# EAGLE schematic AM3352-SOM-EVB_Rev_D (EAGLE 4.16)
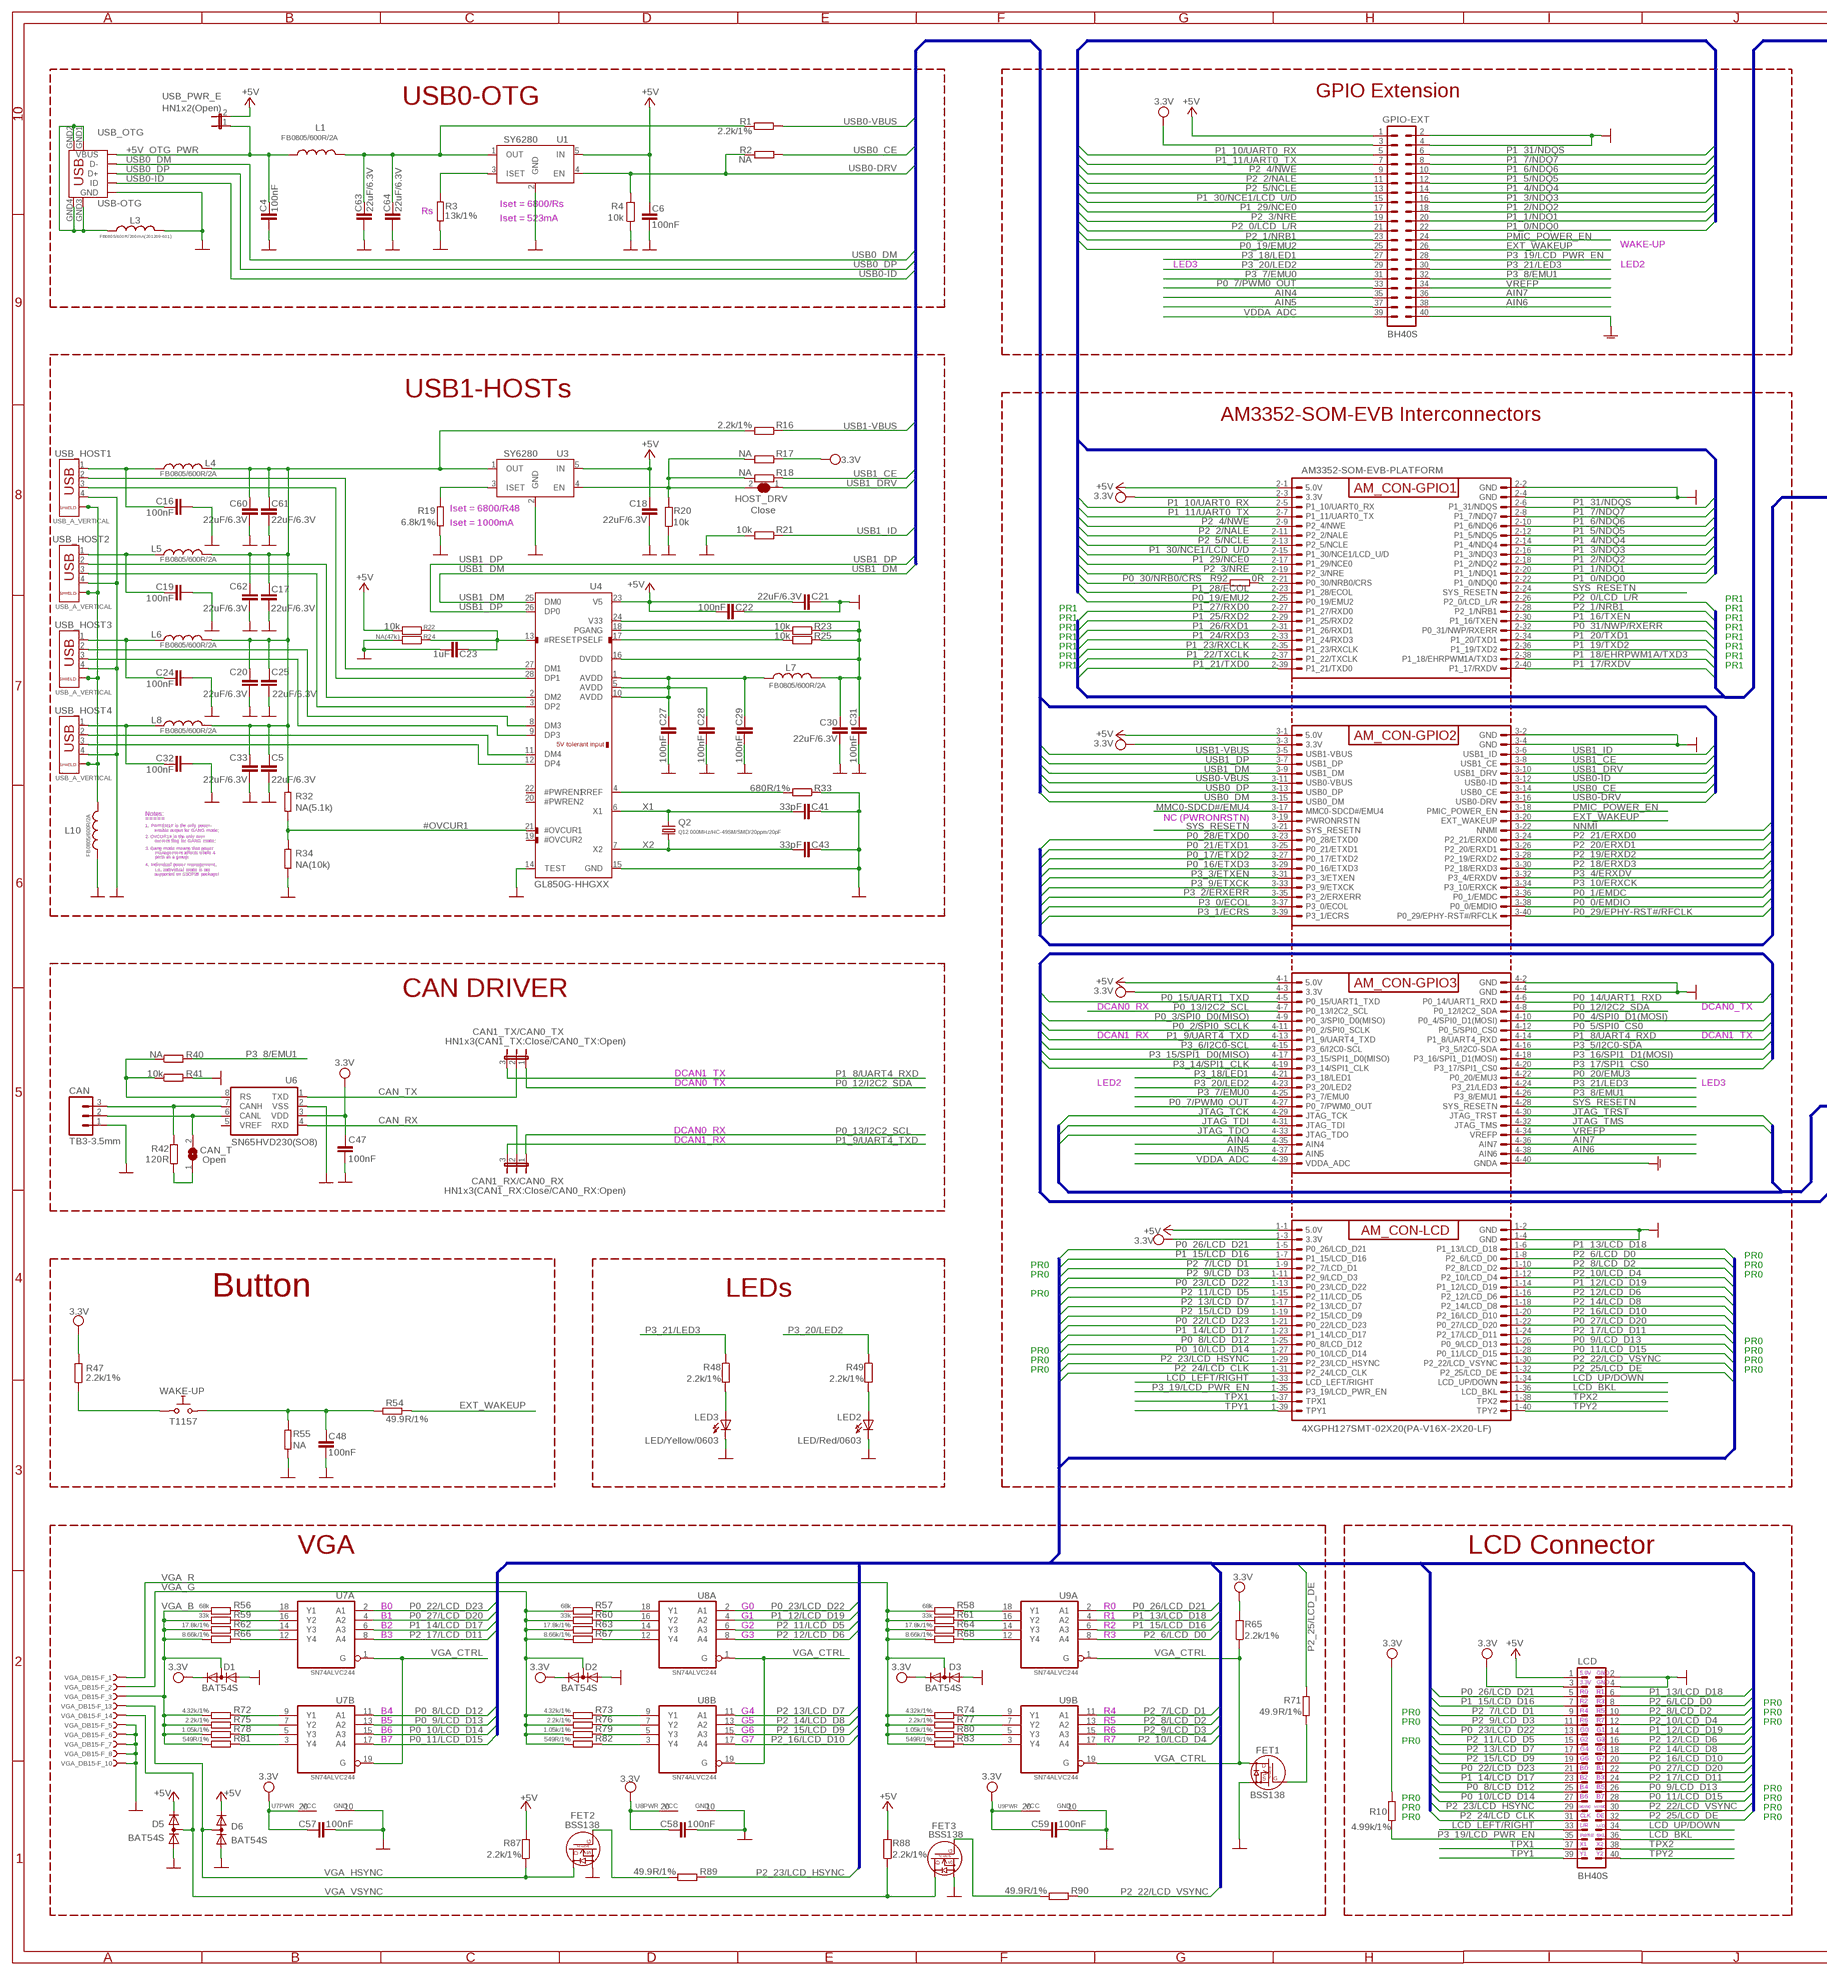
[diagram p0: schematic, sheet 1, part 1 of 2]
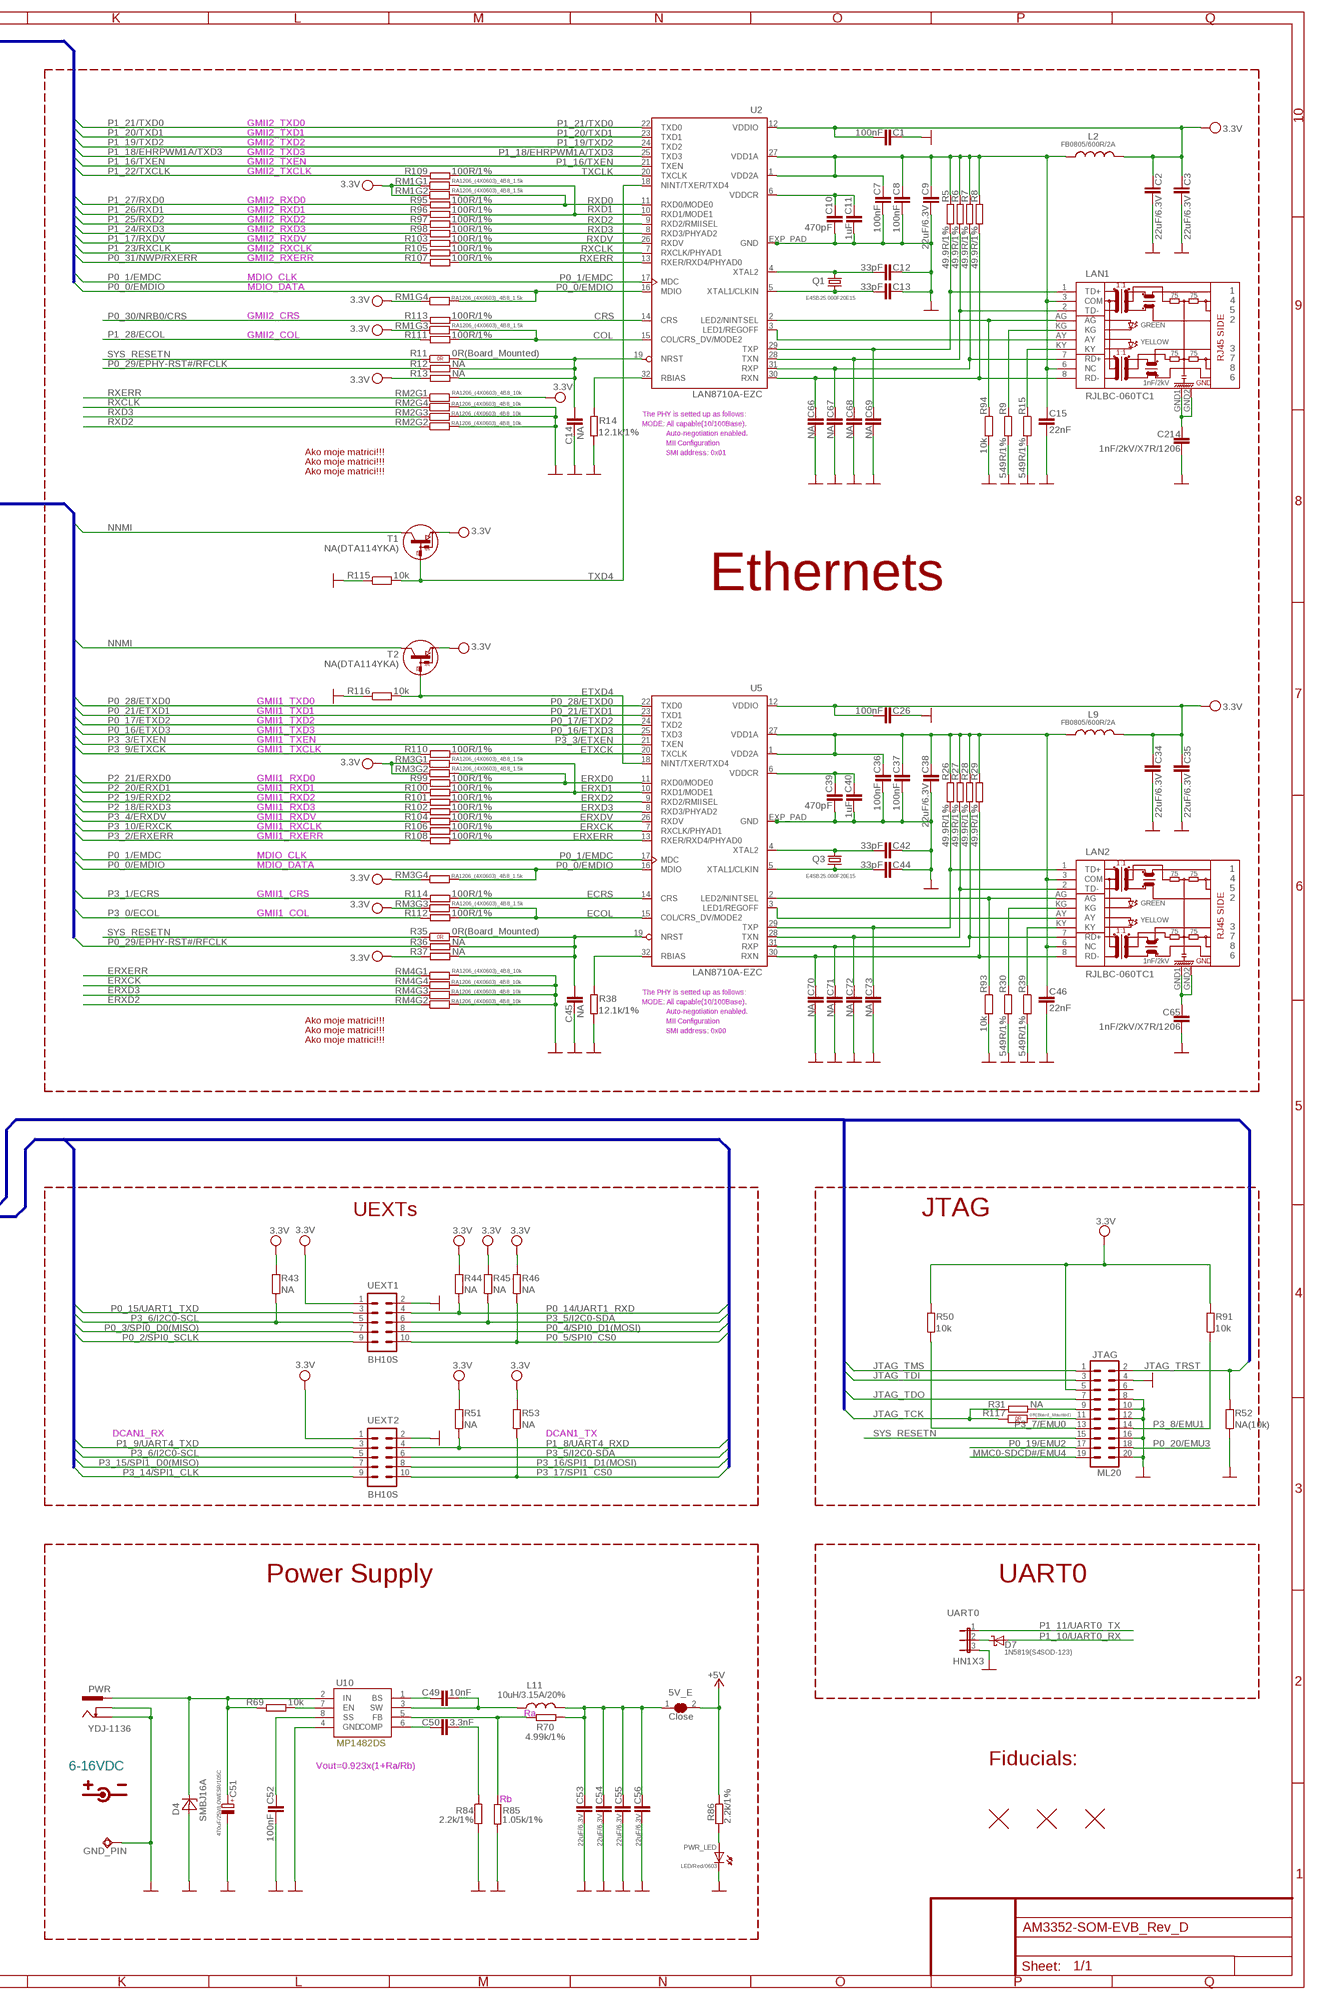
[diagram p1: schematic, sheet 1, part 2 of 2]

## Parts
5V_E  Close  SJSJ-CLOSE  [SJ-CLOSE]
AM3352-SOM-EVB-PLATFORM  4XGPH127SMT-02X20(PA-V16X-2X20-LF)  AM3352-SOM-EVB---4XGPH127SMT-02X20(PA-V16X-2X20-LF)  [AM3352-SOM-EVB]
C1  100nF  C-EUC0603_DWS  [C0603_DWS]
C2  22uF/6.3V  C-EUC0603_DWS  [C0603_DWS]
C3  22uF/6.3V  C-EUC0603_DWS  [C0603_DWS]
C4  100nF  C-EUC0603_DWS  [C0603_DWS]
C5  22uF/6.3V  C-EUC0603_DWS  [C0603_DWS]
C6  100nF  C-EUC0603_DWS  [C0603_DWS]
C7  100nF  C-EUC0603_DWS  [C0603_DWS]
C8  100nF  C-EUC0603_DWS  [C0603_DWS]
C9  22uF/6.3V  C-EUC0603_DWS  [C0603_DWS]
C10  470pF  C-EUC0603_DWS  [C0603_DWS]
C11  1uF  C-EUC0603_DWS  [C0603_DWS]
C12  33pF  C-EUC0603_DWS  [C0603_DWS]
C13  33pF  C-EUC0603_DWS  [C0603_DWS]
C14  NA  C-EUC0603_DWS  [C0603_DWS]
C15  22nF  C-EUC0603_DWS  [C0603_DWS]
C16  100nF  C-EUC0603_DWS  [C0603_DWS]
C17  22uF/6.3V  C-EUC0603_DWS  [C0603_DWS]
C18  22uF/6.3V  C-EUC0603_DWS  [C0603_DWS]
C19  100nF  C-EUC0603_DWS  [C0603_DWS]
C20  22uF/6.3V  C-EUC0603_DWS  [C0603_DWS]
C21  22uF/6.3V  C-EUC0603_DWS  [C0603_DWS]
C22  100nF  C-EUC0603_DWS  [C0603_DWS]
C23  1uF  C-EUC0603_DWS  [C0603_DWS]
C24  100nF  C-EUC0603_DWS  [C0603_DWS]
C25  22uF/6.3V  C-EUC0603_DWS  [C0603_DWS]
C26  100nF  C-EUC0603_DWS  [C0603_DWS]
C27  100nF  C-EUC0603_DWS  [C0603_DWS]
C28  100nF  C-EUC0603_DWS  [C0603_DWS]
C29  100nF  C-EUC0603_DWS  [C0603_DWS]
C30  22uF/6.3V  C-EUC0603_DWS  [C0603_DWS]
C31  100nF  C-EUC0603_DWS  [C0603_DWS]
C32  100nF  C-EUC0603_DWS  [C0603_DWS]
C33  22uF/6.3V  C-EUC0603_DWS  [C0603_DWS]
C34  22uF/6.3V  C-EUC0603_DWS  [C0603_DWS]
C35  22uF/6.3V  C-EUC0603_DWS  [C0603_DWS]
C36  100nF  C-EUC0603_DWS  [C0603_DWS]
C37  100nF  C-EUC0603_DWS  [C0603_DWS]
C38  22uF/6.3V  C-EUC0603_DWS  [C0603_DWS]
C39  470pF  C-EUC0603_DWS  [C0603_DWS]
C40  1uF  C-EUC0603_DWS  [C0603_DWS]
C41  33pF  C-EUC0603_DWS  [C0603_DWS]
C42  33pF  C-EUC0603_DWS  [C0603_DWS]
C43  33pF  C-EUC0603_DWS  [C0603_DWS]
C44  33pF  C-EUC0603_DWS  [C0603_DWS]
C45  NA  C-EUC0603_DWS  [C0603_DWS]
C46  22nF  C-EUC0603_DWS  [C0603_DWS]
C47  100nF  C-EUC0603_DWS  [C0603_DWS]
C48  100nF  C-EUC0603_DWS  [C0603_DWS]
C49  10nF  C-EUC0603_DWS  [C0603_DWS]
C50  3.3nF  C-EUC0603_DWS  [C0603_DWS]
C51  470uF/25V/LOWESR/105C  CPOL-EUE5-10.5  [E5-10,5]
C52  100nF  C-EUC0603_DWS  [C0603_DWS]
C53  22uF/6.3V  C-EUC0603_DWS  [C0603_DWS]
C54  22uF/6.3V  C-EUC0603_DWS  [C0603_DWS]
C55  22uF/6.3V  C-EUC0603_DWS  [C0603_DWS]
C56  22uF/6.3V  C-EUC0603_DWS  [C0603_DWS]
C57  100nF  C-EUC0603_DWS  [C0603_DWS]
C58  100nF  C-EUC0603_DWS  [C0603_DWS]
C59  100nF  C-EUC0603_DWS  [C0603_DWS]
C60  22uF/6.3V  C-EUC0603_DWS  [C0603_DWS]
C61  22uF/6.3V  C-EUC0603_DWS  [C0603_DWS]
C62  22uF/6.3V  C-EUC0603_DWS  [C0603_DWS]
C63  22uF/6.3V  C-EUC0603_DWS  [C0603_DWS]
C64  22uF/6.3V  C-EUC0603_DWS  [C0603_DWS]
C65  1nF/2kV/X7R/1206  C-EUC1206_5MILS_WS_ISO  [C1206_5MILS_WS_ISO]
C66  NA  C-EUC0603_DWS  [C0603_DWS]
C67  NA  C-EUC0603_DWS  [C0603_DWS]
C68  NA  C-EUC0603_DWS  [C0603_DWS]
C69  NA  C-EUC0603_DWS  [C0603_DWS]
C70  NA  C-EUC0603_DWS  [C0603_DWS]
C71  NA  C-EUC0603_DWS  [C0603_DWS]
C72  NA  C-EUC0603_DWS  [C0603_DWS]
C73  NA  C-EUC0603_DWS  [C0603_DWS]
C214  1nF/2kV/X7R/1206  C-EUC1206_5MILS_WS_ISO  [C1206_5MILS_WS_ISO]
CAN  TB3-3.5mm  CON33.5MM  [CON3/3.5MM]
CAN1_RX/CAN0_RX  HN1x3(CAN1_RX:Close/CAN0_RX:Open)  JP2E  [JP2]
CAN1_TX/CAN0_TX  HN1x3(CAN1_TX:Close/CAN0_TX:Open)  JP2E  [JP2]
CAN_T  Open  SJSJ_SMALLER  [SJ_1_SMALLER]
D1  BAT54S  DIODE_AC-AC_  [SOT23C(BAT54S)]
D2  BAT54S  DIODE_AC-AC_  [SOT23C(BAT54S)]
D3  BAT54S  DIODE_AC-AC_  [SOT23C(BAT54S)]
D4  SMBJ16A  [DO214AA]
D5  BAT54S  DIODE_AC-AC_  [SOT23C(BAT54S)]
D6  BAT54S  DIODE_AC-AC_  [SOT23C(BAT54S)]
D7  1N5819(S4SOD-123)  SCHOTKKY7.62SS-1N5819(S4SOD-123)  [SOD-123]
FET1  BSS138  N-MOS+DIODBSS138(SOT23-3)  [SOT23]
FET2  BSS138  N-MOS+DIODBSS138(SOT23-3)  [SOT23]
FET3  BSS138  N-MOS+DIODBSS138(SOT23-3)  [SOT23]
FID1  FIDUCIAL  [FIDUCIAL-1X3]
FID2  FIDUCIAL  [FIDUCIAL-1X3]
FID3  FIDUCIAL  [FIDUCIAL-1X3]
GND_PIN  TESTPAD3  [TEST_PAD40/70/SQUARE]
GPIO-EXT  BH40S  ML40  [ML40]
HOST_DRV  Close  SJSJ_1_SMALLER_CLOSE  [SJ_1_SMALLER_CLOSE]
JTAG  ML20  [ML20-MALE]
L1  FB0805/600R/2A  L-USL0805_5MIL_DWS  [L0805_5MIL_DWS]
L2  FB0805/600R/2A  L-USL0805_5MIL_DWS  [L0805_5MIL_DWS]
L3  FB0805/600R/200mA(201209-601)  L-USL0805_5MIL_DWS  [L0805_5MIL_DWS]
L4  FB0805/600R/2A  L-USL0805_5MIL_DWS  [L0805_5MIL_DWS]
L5  FB0805/600R/2A  L-USL0805_5MIL_DWS  [L0805_5MIL_DWS]
L6  FB0805/600R/2A  L-USL0805_5MIL_DWS  [L0805_5MIL_DWS]
L7  FB0805/600R/2A  L-USL0805_5MIL_DWS  [L0805_5MIL_DWS]
L8  FB0805/600R/2A  L-USL0805_5MIL_DWS  [L0805_5MIL_DWS]
L9  FB0805/600R/2A  L-USL0805_5MIL_DWS  [L0805_5MIL_DWS]
L10  FB0805/600R/2A  L-USL0805_5MIL_DWS  [L0805_5MIL_DWS]
L11  10uH/3.15A/20%  LLQH88PN100M38  [8X8MM_3131]
LAN1  RJLBC-060TC1  RJLBC-060TC1_GND  [RJLBC-060TC1]
LAN2  RJLBC-060TC1  RJLBC-060TC1_GND  [RJLBC-060TC1]
LCD  BH40S  ML40  [ML40]
LED2  LED/Red/0603  LEDLED_0603  [LED_0603]
LED3  LED/Yellow/0603  LEDLED_0603  [LED_0603]
PWR  YDJ-1136  PWR-JAKPWR_JACK_UNI_MILLING  [PWR_JACK_UNI_MILLING]
PWR_LED  LED/Red/0603  LED0603DWS  [LED-0603]
Q1  E4SB25.000F20E15  HC49/S_E4SB25.000F20E15  [HCX-4S]
Q2  Q12.000MHz/HC-49SM/SMD/20ppm/20pF  HC49/S1  [HC49/SMD2_THIN]
Q3  E4SB25.000F20E15  HC49/S_E4SB25.000F20E15  [HCX-4S]
R1  2.2k/1%  R-EU_R0603_5MIL_DWS  [R0603_5MIL_DWS]
R2  NA  R-EU_R0603_5MIL_DWS  [R0603_5MIL_DWS]
R3  13k/1%  R-EU_R0603_5MIL_DWS  [R0603_5MIL_DWS]
R4  10k  R-EU_R0603_5MIL_DWS  [R0603_5MIL_DWS]
R5  49.9R/1%  R-EU_R0603_5MIL_DWS  [R0603_5MIL_DWS]
R6  49.9R/1%  R-EU_R0603_5MIL_DWS  [R0603_5MIL_DWS]
R7  49.9R/1%  R-EU_R0603_5MIL_DWS  [R0603_5MIL_DWS]
R8  49.9R/1%  R-EU_R0603_5MIL_DWS  [R0603_5MIL_DWS]
R9  549R/1%  R-EU_R0603_5MIL_DWS  [R0603_5MIL_DWS]
R10  4.99k/1%  R-EU_R0603_5MIL_DWS  [R0603_5MIL_DWS]
R11  0R(Board_Mounted)  R_0R0R(NA)  [0603_0R]
R12  NA  R-EU_R0603_5MIL_DWS  [R0603_5MIL_DWS]
R13  NA  R-EU_R0603_5MIL_DWS  [R0603_5MIL_DWS]
R14  12.1k/1%  R-EU_R0603_5MIL_DWS  [R0603_5MIL_DWS]
R15  549R/1%  R-EU_R0603_5MIL_DWS  [R0603_5MIL_DWS]
R16  2.2k/1%  R-EU_R0603_5MIL_DWS  [R0603_5MIL_DWS]
R17  NA  R-EU_R0603_5MIL_DWS  [R0603_5MIL_DWS]
R18  NA  R-EU_R0603_5MIL_DWS  [R0603_5MIL_DWS]
R19  6.8k/1%  R-EU_R0603_5MIL_DWS  [R0603_5MIL_DWS]
R20  10k  R-EU_R0603_5MIL_DWS  [R0603_5MIL_DWS]
R21  10k  R-EU_R0603_5MIL_DWS  [R0603_5MIL_DWS]
R22  10k  R-EU_R0603_5MIL_DWS  [R0603_5MIL_DWS]
R23  10k  R-EU_R0603_5MIL_DWS  [R0603_5MIL_DWS]
R24  NA(47k)  R-EU_R0603_5MIL_DWS  [R0603_5MIL_DWS]
R25  10k  R-EU_R0603_5MIL_DWS  [R0603_5MIL_DWS]
R26  49.9R/1%  R-EU_R0603_5MIL_DWS  [R0603_5MIL_DWS]
R27  49.9R/1%  R-EU_R0603_5MIL_DWS  [R0603_5MIL_DWS]
R28  49.9R/1%  R-EU_R0603_5MIL_DWS  [R0603_5MIL_DWS]
R29  49.9R/1%  R-EU_R0603_5MIL_DWS  [R0603_5MIL_DWS]
R30  549R/1%  R-EU_R0603_5MIL_DWS  [R0603_5MIL_DWS]
R31  NA  R-EU_R0603_5MIL_DWS  [R0603_5MIL_DWS]
R32  NA(5.1k)  R-EU_R0603_5MIL_DWS  [R0603_5MIL_DWS]
R33  680R/1%  R-EU_R0603_5MIL_DWS  [R0603_5MIL_DWS]
R34  NA(10k)  R-EU_R0603_5MIL_DWS  [R0603_5MIL_DWS]
R35  0R(Board_Mounted)  R_0R0R(NA)  [0603_0R]
R36  NA  R-EU_R0603_5MIL_DWS  [R0603_5MIL_DWS]
R37  NA  R-EU_R0603_5MIL_DWS  [R0603_5MIL_DWS]
R38  12.1k/1%  R-EU_R0603_5MIL_DWS  [R0603_5MIL_DWS]
R39  549R/1%  R-EU_R0603_5MIL_DWS  [R0603_5MIL_DWS]
R40  NA  R-EU_R0603_5MIL_DWS  [R0603_5MIL_DWS]
R41  10k  R-EU_R0603_5MIL_DWS  [R0603_5MIL_DWS]
R42  120R  R-EU_R1206_5MIL_WS  [R1206_5MIL_WS]
R43  NA  R-EU_R0603_5MIL_DWS  [R0603_5MIL_DWS]
R44  NA  R-EU_R0603_5MIL_DWS  [R0603_5MIL_DWS]
R45  NA  R-EU_R0603_5MIL_DWS  [R0603_5MIL_DWS]
R46  NA  R-EU_R0603_5MIL_DWS  [R0603_5MIL_DWS]
R47  2.2k/1%  R-EU_R0603_5MIL_DWS  [R0603_5MIL_DWS]
R48  2.2k/1%  R-EU_R0603_5MIL_DWS  [R0603_5MIL_DWS]
R49  2.2k/1%  R-EU_R0603_5MIL_DWS  [R0603_5MIL_DWS]
R50  10k  R-EU_R0603_5MIL_DWS  [R0603_5MIL_DWS]
R51  NA  R-EU_R0603_5MIL_DWS  [R0603_5MIL_DWS]
R52  NA(10k)  R-EU_R0603_5MIL_DWS  [R0603_5MIL_DWS]
R53  NA  R-EU_R0603_5MIL_DWS  [R0603_5MIL_DWS]
R54  49.9R/1%  R-EU_R0603_5MIL_DWS  [R0603_5MIL_DWS]
R55  NA  R-EU_R0603_5MIL_DWS  [R0603_5MIL_DWS]
R56  68k  R-EU_R0603_5MIL_DWS  [R0603_5MIL_DWS]
R57  68k  R-EU_R0603_5MIL_DWS  [R0603_5MIL_DWS]
R58  68k  R-EU_R0603_5MIL_DWS  [R0603_5MIL_DWS]
R59  33k  R-EU_R0603_5MIL_DWS  [R0603_5MIL_DWS]
R60  33k  R-EU_R0603_5MIL_DWS  [R0603_5MIL_DWS]
R61  33k  R-EU_R0603_5MIL_DWS  [R0603_5MIL_DWS]
R62  17.8k/1%  R-EU_R0603_5MIL_DWS  [R0603_5MIL_DWS]
R63  17.8k/1%  R-EU_R0603_5MIL_DWS  [R0603_5MIL_DWS]
R64  17.8k/1%  R-EU_R0603_5MIL_DWS  [R0603_5MIL_DWS]
R65  2.2k/1%  R-EU_R0603_5MIL_DWS  [R0603_5MIL_DWS]
R66  8.66k/1%  R-EU_R0603_5MIL_DWS  [R0603_5MIL_DWS]
R67  8.66k/1%  R-EU_R0603_5MIL_DWS  [R0603_5MIL_DWS]
R68  8.66k/1%  R-EU_R0603_5MIL_DWS  [R0603_5MIL_DWS]
R69  10k  R-EU_R0603_5MIL_DWS  [R0603_5MIL_DWS]
R70  4.99k/1%  R-EU_R0603_5MIL_DWS  [R0603_5MIL_DWS]
R71  49.9R/1%  R-EU_R0603_5MIL_DWS  [R0603_5MIL_DWS]
R72  4.32k/1%  R-EU_R0603_5MIL_DWS  [R0603_5MIL_DWS]
R73  4.32k/1%  R-EU_R0603_5MIL_DWS  [R0603_5MIL_DWS]
R74  4.32k/1%  R-EU_R0603_5MIL_DWS  [R0603_5MIL_DWS]
R75  2.2k/1%  R-EU_R0603_5MIL_DWS  [R0603_5MIL_DWS]
R76  2.2k/1%  R-EU_R0603_5MIL_DWS  [R0603_5MIL_DWS]
R77  2.2k/1%  R-EU_R0603_5MIL_DWS  [R0603_5MIL_DWS]
R78  1.05k/1%  R-EU_R0603_5MIL_DWS  [R0603_5MIL_DWS]
R79  1.05k/1%  R-EU_R0603_5MIL_DWS  [R0603_5MIL_DWS]
R80  1.05k/1%  R-EU_R0603_5MIL_DWS  [R0603_5MIL_DWS]
R81  549R/1%  R-EU_R0603_5MIL_DWS  [R0603_5MIL_DWS]
R82  549R/1%  R-EU_R0603_5MIL_DWS  [R0603_5MIL_DWS]
R83  549R/1%  R-EU_R0603_5MIL_DWS  [R0603_5MIL_DWS]
R84  2.2k/1%  R-EU_R0603_5MIL_DWS  [R0603_5MIL_DWS]
R85  1.05k/1%  R-EU_R0603_5MIL_DWS  [R0603_5MIL_DWS]
R86  2.2k/1%  R-EU_R0603_5MIL_DWS  [R0603_5MIL_DWS]
R87  2.2k/1%  R-EU_R0603_5MIL_DWS  [R0603_5MIL_DWS]
R88  2.2k/1%  R-EU_R0603_5MIL_DWS  [R0603_5MIL_DWS]
R89  49.9R/1%  R-EU_R0603_5MIL_DWS  [R0603_5MIL_DWS]
R90  49.9R/1%  R-EU_R0603_5MIL_DWS  [R0603_5MIL_DWS]
R91  10k  R-EU_R0603_5MIL_DWS  [R0603_5MIL_DWS]
R92  0R  R-EU_R0603_5MIL_DWS  [R0603_5MIL_DWS]
R93  10k  R-EU_R0603_5MIL_DWS  [R0603_5MIL_DWS]
R94  10k  R-EU_R0603_5MIL_DWS  [R0603_5MIL_DWS]
R95  100R/1%  R-EU_R0402_TI  [R0402_TI]
R96  100R/1%  R-EU_R0402_TI  [R0402_TI]
R97  100R/1%  R-EU_R0402_TI  [R0402_TI]
R98  100R/1%  R-EU_R0402_TI  [R0402_TI]
R99  100R/1%  R-EU_R0402_TI  [R0402_TI]
R100  100R/1%  R-EU_R0402_TI  [R0402_TI]
R101  100R/1%  R-EU_R0402_TI  [R0402_TI]
R102  100R/1%  R-EU_R0402_TI  [R0402_TI]
R103  100R/1%  R-EU_R0402_TI  [R0402_TI]
R104  100R/1%  R-EU_R0402_TI  [R0402_TI]
R105  100R/1%  R-EU_R0402_TI  [R0402_TI]
R106  100R/1%  R-EU_R0402_TI  [R0402_TI]
R107  100R/1%  R-EU_R0402_TI  [R0402_TI]
R108  100R/1%  R-EU_R0402_TI  [R0402_TI]
R109  100R/1%  R-EU_R0402_TI  [R0402_TI]
R110  100R/1%  R-EU_R0402_TI  [R0402_TI]
R111  100R/1%  R-EU_R0402_TI  [R0402_TI]
R112  100R/1%  R-EU_R0402_TI  [R0402_TI]
R113  100R/1%  R-EU_R0402_TI  [R0402_TI]
R114  100R/1%  R-EU_R0402_TI  [R0402_TI]
R115  10k  R-EU_R0603_5MIL_DWS  [R0603_5MIL_DWS]
R116  10k  R-EU_R0603_5MIL_DWS  [R0603_5MIL_DWS]
R117  0R(Board_Mounted)  R_0R0R(NA)  [0603_0R]
RM1  RA1206_(4X0603)_4B8_1.5k  R_MATRIX_4E  [R_MATRIX_4]
RM2  RA1206_(4X0603)_4B8_10k  R_MATRIX_4E  [R_MATRIX_4]
RM3  RA1206_(4X0603)_4B8_1.5k  R_MATRIX_4E  [R_MATRIX_4]
RM4  RA1206_(4X0603)_4B8_10k  R_MATRIX_4E  [R_MATRIX_4]
T1  NA(DTA114YKA)  DIGITAL_TRANSISTORS-PNPDTA114YKA  [SOT-23]
T2  NA(DTA114YKA)  DIGITAL_TRANSISTORS-PNPDTA114YKA  [SOT-23]
U1  SY6280  [SOT23-5]
U2  LAN8710A-EZC  [QFN-32(DRILLS)]
U3  SY6280  [SOT23-5]
U4  GL850G-HHGXX  GL850G  [SSOP28]
U5  LAN8710A-EZC  [QFN-32(DRILLS)]
U6  SN65HVD230(SO8)  MCP2551  [SO-08]
U7  SN74ALVC244  74ALVC244  [PW]
U8  SN74ALVC244  74ALVC244  [PW]
U9  SN74ALVC244  74ALVC244  [PW]
U10  MP1482DS  MP1482  [SOIC8]
UART0  HN1X3  JP2E  [JP2]
UEXT1  BH10S  ML10  [ML10-MALE]
UEXT2  BH10S  ML10  [ML10-MALE]
USB_HOST1  USB_A_VERTICAL  USB_SHIELDUSB_A_VERTICAL  [USB_A_VERTICAL_PTH]
USB_HOST2  USB_A_VERTICAL  USB_SHIELDUSB_A_VERTICAL  [USB_A_VERTICAL_PTH]
USB_HOST3  USB_A_VERTICAL  USB_SHIELDUSB_A_VERTICAL  [USB_A_VERTICAL_PTH]
USB_HOST4  USB_A_VERTICAL  USB_SHIELDUSB_A_VERTICAL  [USB_A_VERTICAL_PTH]
USB_OTG  USB-OTG  MINI_USB9  [USB_MINI_9PIN]
USB_PWR_E  HN1x2(Open)  JP1E  [JP1]
VGA_DB15-F  VGA_DB15-F  DB1522  [DB15-F_22MM]
WAKE-UP  T1157  SW-TAKT""  [T1157]

## Nets
#OVCUR1: R32.1 R34.2 U4.21(#OVCUR1)
+5V: 5V_E.2 AM3352-SOM-EVB-PLATFORM.1-1(5.0V) AM3352-SOM-EVB-PLATFORM.2-1(5.0V) AM3352-SOM-EVB-PLATFORM.3-1(5.0V) AM3352-SOM-EVB-PLATFORM.4-1(5.0V) C6.1 C18.1 C21.1 C22.1 D5.2(K) D6.2(K) GPIO-EXT.1 LCD.1 R22.2 R86.1 R87.2 R88.2 U1.5(IN) U3.5(IN) U4.23(V5) USB_PWR_E.2
+5V_OTG_PWR: C4.1 L1.1 USB_OTG.VBUS USB_PWR_E.1
AIN4: AM3352-SOM-EVB-PLATFORM.4-35(AIN4) GPIO-EXT.35
AIN5: AM3352-SOM-EVB-PLATFORM.4-37(AIN5) GPIO-EXT.37
AIN6: AM3352-SOM-EVB-PLATFORM.4-38(AIN6) GPIO-EXT.38
AIN7: AM3352-SOM-EVB-PLATFORM.4-36(AIN7) GPIO-EXT.36
AVDD: C27.1 C28.1 C29.1 L7.2 U4.1(AVDD) U4.5(AVDD) U4.10(AVDD)
CAN_RX: CAN1_RX/CAN0_RX.2 U6.4(RXD)
CAN_TX: CAN1_TX/CAN0_TX.2 U6.1(TXD)
CANH: CAN.3 R42.2 U6.7(CANH)
CANL: CAN.2 CAN_T.2 U6.6(CANL)
COL: R111.2 RM1.3.2 U2.15(COL/CRS_DV/MODE2)
CRS: R113.2 U2.14(CRS)
DM1: U4.27(DM1) USB_HOST1.2
DM2: U4.2(DM2) USB_HOST2.2
DM3: U4.8(DM3) USB_HOST3.2
DM4: U4.11(DM4) USB_HOST4.2
DP1: U4.28(DP1) USB_HOST1.3
DP2: U4.3(DP2) USB_HOST2.3
DP3: U4.9(DP3) USB_HOST3.3
DP4: U4.12(DP4) USB_HOST4.3
DVDD1: C30.1 C31.1 L7.1 R23.1 R25.1 U4.16(DVDD) U4.24(V33)
ECOL: R112.2 RM3.3.2 U5.15(COL/CRS_DV/MODE2)
ECRS: R114.2 U5.14(CRS)
ENRST: C45.2 R35.2(1.2) R36.2 R37.2 U5.19(NRST)
ERXCK: R106.2 RM4.4.1 U5.7(RXCLK/PHYAD1)
ERXD0: R99.2 RM3.2.2 U5.11(RXD0/MODE0)
ERXD1: R100.2 RM3.1.2 U5.10(RXD1/MODE1)
ERXD2: R101.2 RM4.2.1 U5.9(RXD2/RMIISEL)
ERXD3: R102.2 RM4.3.1 U5.8(RXD3/PHYAD2)
ERXDV: R104.2 U5.26(RXDV)
ERXERR: R108.2 RM4.1.1 U5.13(RXER/RXD4/PHYAD0)
ETXCK: R110.2 U5.20(TXCLK)
ETXD4: R116.2 T2.1(B) U5.18(NINT/TXER/TXD4)
EXT_WAKEUP: AM3352-SOM-EVB-PLATFORM.3-20(EXT_WAKEUP) GPIO-EXT.26 R54.1
GND [PWR]: AM3352-SOM-EVB-PLATFORM.1-2(GND) AM3352-SOM-EVB-PLATFORM.1-4(GND) AM3352-SOM-EVB-PLATFORM.2-2(GND) AM3352-SOM-EVB-PLATFORM.2-4(GND) AM3352-SOM-EVB-PLATFORM.3-2(GND) AM3352-SOM-EVB-PLATFORM.3-4(GND) AM3352-SOM-EVB-PLATFORM.4-2(GND) AM3352-SOM-EVB-PLATFORM.4-4(GND) C1.1 C2.1 C3.1 C4.2 C5.2 C6.2 C7.1 C8.1 C9.1 C10.1 C11.1 C12.1 C13.1 C14.1 C15.1 C16.2 C17.2 C18.2 C19.2 C20.2 C21.2 C22.2 C23.1 C24.2 C25.2 C26.1 C27.2 C28.2 C29.2 C30.2 C31.2 C32.2 C33.2 C34.1 C35.1 C36.1 C37.1 C38.1 C39.1 C40.1 C41.1 C42.1 C43.1 C44.1 C45.1 C46.1 C47.2 C48.2 C51.- C52.2 C53.2 C54.2 C55.2 C56.2 C57.2 C58.2 C59.2 C60.2 C61.2 C62.2 C63.2 C64.2 C65.1 C66.1 C67.1 C68.1 C69.1 C70.1 C71.1 C72.1 C73.1 C214.1 CAN.1 D1.1(A) D2.1(A) D3.1(A) D4.A D5.1(A) D6.1(A) FET1.2(S) FET2.2(S) FET3.2(S) GND_PIN.P$1(PP) GPIO-EXT.2 GPIO-EXT.4 JTAG.4 JTAG.8 JTAG.10 JTAG.12 JTAG.16 JTAG.20 L3.1 L10.1 LCD.2 LCD.4 LED2.C LED3.C PWR.- PWR.-- PWR_LED.C R3.1 R4.1 R9.2 R14.1 R15.2 R19.1 R20.1 R21.2 R24.2 R30.2 R33.1 R34.1 R38.1 R39.2 R41.2 R52.1 R55.2 R84.2 R85.2 R93.2 R94.2 R115.1 R116.1 RM2.2.2 RM2.3.2 RM2.4.2 RM4.1.2 RM4.2.2 RM4.3.2 RM4.4.2 U1.2(GND) U2.EP1(GND1) U2.EP2(GND2) U2.EP3(GND3) U2.EP4(GND4) U2.EP5(GND5) U2.EP6(GND6) U2.EP7(GND7) U2.EP8(GND8) U2.EP9(GND9) U2.EXP_PAD(GND) U3.2(GND) U4.14(TEST) U4.15(GND) U5.EP1(GND1) U5.EP2(GND2) U5.EP3(GND3) U5.EP4(GND4) U5.EP5(GND5) U5.EP6(GND6) U5.EP7(GND7) U5.EP8(GND8) U5.EP9(GND9) U5.EXP_PAD(GND) U6.2(VSS) U7.10(PWR:GND) U8.10(PWR:GND) U9.10(PWR:GND) U10.4(GND) UART0.3 UEXT1.2 UEXT2.2 USB_HOST1.4 USB_HOST2.4 USB_HOST3.4 USB_HOST4.4 USB_OTG.GND VGA_DB15-F.5 VGA_DB15-F.6 VGA_DB15-F.7 VGA_DB15-F.8 VGA_DB15-F.10
GNDA: AM3352-SOM-EVB-PLATFORM.4-40(GNDA) GPIO-EXT.40
JTAG_TCK: AM3352-SOM-EVB-PLATFORM.4-29(JTAG_TCK) R31.1 R117.1(1.1)
JTAG_TDI: AM3352-SOM-EVB-PLATFORM.4-31(JTAG_TDI) JTAG.3
JTAG_TDO: AM3352-SOM-EVB-PLATFORM.4-33(JTAG_TDO) JTAG.7
JTAG_TMS: AM3352-SOM-EVB-PLATFORM.4-32(JTAG_TMS) JTAG.1
JTAG_TRST: AM3352-SOM-EVB-PLATFORM.4-30(JTAG_TRST) JTAG.2 R52.2
LCD_BKL: AM3352-SOM-EVB-PLATFORM.1-36(LCD_BKL) LCD.36
LCD_LEFT/RIGHT: AM3352-SOM-EVB-PLATFORM.1-33(LCD_LEFT/RIGHT) LCD.33
LCD_UP/DOWN: AM3352-SOM-EVB-PLATFORM.1-34(LCD_UP/DOWN) LCD.34
MMC0-SDCD#/EMU4: AM3352-SOM-EVB-PLATFORM.3-17(MMC0-SDCD#/EMU4) JTAG.19
N$1: LED2.A R49.2
N$2: R38.2 U5.32(RBIAS)
N$3: C51.+ D4.C PWR.+ R69.1 U10.2(IN)
N$4: C52.1 U10.8(SS)
N$5: R78.1 U7.5(B:Y3)
N$6: R69.2 U10.7(EN)
N$7: C49.1 U10.1(BS)
N$8: C49.2 L11.1 U10.3(SW)
N$9: C50.1 U10.6(COMP)
N$10: LAN2.AG R93.1 U5.2(LED2/NINTSEL)
N$11: C50.2 R84.1
N$12 [PWR]: 5V_E.1 C53.1 C54.1 C55.1 C56.1 L11.2 R70.2
N$13: AM3352-SOM-EVB-PLATFORM.2-21(P0_30/NRB0/CRS) R92.2
N$14: C39.2 C40.2 U5.6(VDDCR)
N$15: C69.2 LAN1.1(TD+) R5.1 U2.29(TXP)
N$16: D7.C UART0.2
N$17: C36.2 C37.2 C38.2 C46.2 L9.1 LAN2.3(COM) LAN2.6(NC) R26.2 R27.2 R28.2 R29.2 U5.1(VDD2A) U5.27(VDD1A)
N$18 [PWR]: C214.2 LAN1.GND1 LAN1.GND2
N$19 [PWR]: C65.2 LAN2.GND1 LAN2.GND2
N$20: C68.2 LAN1.2(TD-) R6.1 U2.28(TXN)
N$21: C67.2 LAN1.7(RD+) R7.1 U2.31(RXP)
N$22: LAN1.KG R9.1
N$23: LAN2.KG R30.1
N$24: C66.2 LAN1.8(RD-) R8.1 U2.30(RXN)
N$25: JTAG.9 R31.2
N$26: LAN1.AY U2.3(LED1/REGOFF)
N$27: JTAG.11 R117.2(1.2)
N$28: LAN1.AG R94.1 U2.2(LED2/NINTSEL)
N$29: LAN1.KY R15.1
N$30: R14.2 U2.32(RBIAS)
N$31: C10.2 C11.2 U2.6(VDDCR)
N$33: C7.2 C8.2 C9.2 C15.2 L2.1 LAN1.3(COM) LAN1.6(NC) R5.2 R6.2 R7.2 R8.2 U2.1(VDD2A) U2.27(VDD1A)
N$38: R72.1 U7.9(B:Y1)
N$39: C73.2 LAN2.1(TD+) R26.1 U5.29(TXP)
N$40: C72.2 LAN2.2(TD-) R27.1 U5.28(TXN)
N$41: C71.2 LAN2.7(RD+) R28.1 U5.31(RXP)
N$42: R19.2 U3.3(ISET)
N$43: R47.1 WAKE-UP.2
N$44: C48.1 R54.2 R55.1 WAKE-UP.1
N$45: C70.2 LAN2.8(RD-) R29.1 U5.30(RXN)
N$46: R62.1 U7.14(A:Y3)
N$47: FET3.1(G) R90.2
N$49: FET2.1(G) R89.2
N$50: FET1.1(G) R71.2
N$51: R61.1 U9.16(A:Y2)
N$52: R58.1 U9.18(A:Y1)
N$54: LAN2.AY U5.3(LED1/REGOFF)
N$55: R60.1 U8.16(A:Y2)
N$57: LAN2.KY R39.1
N$59: R57.1 U8.18(A:Y1)
N$60: R59.1 U7.16(A:Y2)
N$61: R56.1 U7.18(A:Y1)
N$62: R70.1 R85.1 U10.5(FB)
N$67: R33.2 U4.4(RREF)
N$68: R23.2 U4.18(PGANG)
N$78: L10.2 USB_HOST1.P$3 USB_HOST1.P$4 USB_HOST2.P$3 USB_HOST2.P$4 USB_HOST3.P$3 USB_HOST3.P$4 USB_HOST4.P$3 USB_HOST4.P$4
N$79: C16.1 L4.2 USB_HOST1.1
N$80: R40.1 R41.1 U6.8(RS)
N$81 [PWR]: HOST_DRV.2 R17.2 R18.2 R20.2 U3.4(EN)
N$82: C32.1 L8.2 USB_HOST4.1
N$83: C5.1 C17.1 C20.1 C25.1 C33.1 C60.1 C61.1 C62.1 L4.1 L5.1 L6.1 L8.1 R16.2 R32.2 U3.1(OUT)
N$99: R3.2 U1.3(ISET)
N$100: C63.1 C64.1 L1.2 R1.2 U1.1(OUT)
N$103: R81.1 U7.3(B:Y4)
N$106: R25.2 U4.17(PSELF)
N$107: R75.1 U7.7(B:Y2)
N$109: R66.1 U7.12(A:Y4)
N$112: C19.1 L5.2 USB_HOST2.1
N$113: C24.1 L6.2 USB_HOST3.1
N$117: R73.1 U8.9(B:Y1)
N$118: R76.1 U8.7(B:Y2)
N$119: C23.2 R22.1 R24.1 U4.13(#RESET)
N$129: PWR_LED.A R86.2
N$138: R79.1 U8.5(B:Y3)
N$172: R82.1 U8.3(B:Y4)
N$173: R63.1 U8.14(A:Y3)
N$174: R67.1 U8.12(A:Y4)
N$177: R74.1 U9.9(B:Y1)
N$178: R77.1 U9.7(B:Y2)
N$179: R80.1 U9.5(B:Y3)
N$180: R83.1 U9.3(B:Y4)
N$181: R64.1 U9.14(A:Y3)
N$182: R68.1 U9.12(A:Y4)
N$231: LED3.A R48.2
N$266: L3.2 USB_OTG.GND1 USB_OTG.GND2 USB_OTG.GND3 USB_OTG.GND4
N$566: CAN_T.1 R42.1
NNMI: AM3352-SOM-EVB-PLATFORM.3-22(NNMI) T1.3(C) T2.3(C)
NRST: C14.2 R11.2(1.2) R12.2 R13.2 U2.19(NRST)
P0_0/EMDIO: AM3352-SOM-EVB-PLATFORM.3-38(P0_0/EMDIO) RM1.4.2 RM3.4.2 U2.16(MDIO) U5.16(MDIO)
P0_1/EMDC: AM3352-SOM-EVB-PLATFORM.3-36(P0_1/EMDC) U2.17(MDC) U5.17(MDC)
P0_2/SPI0_SCLK: AM3352-SOM-EVB-PLATFORM.4-11(P0_2/SPI0_SCLK) UEXT1.9
P0_3/SPI0_D0(MISO): AM3352-SOM-EVB-PLATFORM.4-9(P0_3/SPI0_D0(MISO)) UEXT1.7
P0_4/SPI0_D1(MOSI): AM3352-SOM-EVB-PLATFORM.4-10(P0_4/SPI0_D1(MOSI)) UEXT1.8
P0_5/SPI0_CS0: AM3352-SOM-EVB-PLATFORM.4-12(P0_5/SPI0_CS0) R46.1 UEXT1.10
P0_7/PWM0_OUT: AM3352-SOM-EVB-PLATFORM.4-27(P0_7/PWM0_OUT) GPIO-EXT.33
P0_8/LCD_D12: AM3352-SOM-EVB-PLATFORM.1-25(P0_8/LCD_D12) LCD.25 U7.11(B:A1)
P0_9/LCD_D13: AM3352-SOM-EVB-PLATFORM.1-26(P0_9/LCD_D13) LCD.26 U7.13(B:A2)
P0_10/LCD_D14: AM3352-SOM-EVB-PLATFORM.1-27(P0_10/LCD_D14) LCD.27 U7.15(B:A3)
P0_11/LCD_D15: AM3352-SOM-EVB-PLATFORM.1-28(P0_11/LCD_D15) LCD.28 U7.17(B:A4)
P0_12/I2C2_SDA: AM3352-SOM-EVB-PLATFORM.4-8(P0_12/I2C2_SDA) CAN1_TX/CAN0_TX.1
P0_13/I2C2_SCL: AM3352-SOM-EVB-PLATFORM.4-7(P0_13/I2C2_SCL) CAN1_RX/CAN0_RX.1
P0_14/UART1_RXD: AM3352-SOM-EVB-PLATFORM.4-6(P0_14/UART1_RXD) R44.1 UEXT1.4
P0_15/UART1_TXD: AM3352-SOM-EVB-PLATFORM.4-5(P0_15/UART1_TXD) UEXT1.3
P0_16/ETXD3: AM3352-SOM-EVB-PLATFORM.3-29(P0_16/ETXD3) U5.25(TXD3)
P0_17/ETXD2: AM3352-SOM-EVB-PLATFORM.3-27(P0_17/ETXD2) U5.24(TXD2)
P0_19/EMU2: AM3352-SOM-EVB-PLATFORM.2-25(P0_19/EMU2) GPIO-EXT.25 JTAG.17
P0_20/EMU3: AM3352-SOM-EVB-PLATFORM.4-22(P0_20/EMU3) JTAG.18
P0_21/ETXD1: AM3352-SOM-EVB-PLATFORM.3-25(P0_21/ETXD1) U5.23(TXD1)
P0_22/LCD_D23: AM3352-SOM-EVB-PLATFORM.1-21(P0_22/LCD_D23) LCD.21 U7.2(A:A1)
P0_23/LCD_D22: AM3352-SOM-EVB-PLATFORM.1-13(P0_23/LCD_D22) LCD.13 U8.2(A:A1)
P0_26/LCD_D21: AM3352-SOM-EVB-PLATFORM.1-5(P0_26/LCD_D21) LCD.5 U9.2(A:A1)
P0_27/LCD_D20: AM3352-SOM-EVB-PLATFORM.1-22(P0_27/LCD_D20) LCD.22 U7.4(A:A2)
P0_28/ETXD0: AM3352-SOM-EVB-PLATFORM.3-23(P0_28/ETXD0) U5.22(TXD0)
P0_29/EPHY-RST#/RFCLK: AM3352-SOM-EVB-PLATFORM.3-40(P0_29/EPHY-RST#/RFCLK) R12.1 R36.1
P0_30/NRB0/CRS: R92.1 R113.1
P0_31/NWP/RXERR: AM3352-SOM-EVB-PLATFORM.2-32(P0_31/NWP/RXERR) R107.1
P1_0/NDQ0: AM3352-SOM-EVB-PLATFORM.2-22(P1_0/NDQ0) GPIO-EXT.22
P1_1/NDQ1: AM3352-SOM-EVB-PLATFORM.2-20(P1_1/NDQ1) GPIO-EXT.20
P1_2/NDQ2: AM3352-SOM-EVB-PLATFORM.2-18(P1_2/NDQ2) GPIO-EXT.18
P1_3/NDQ3: AM3352-SOM-EVB-PLATFORM.2-16(P1_3/NDQ3) GPIO-EXT.16
P1_4/NDQ4: AM3352-SOM-EVB-PLATFORM.2-14(P1_4/NDQ4) GPIO-EXT.14
P1_5/NDQ5: AM3352-SOM-EVB-PLATFORM.2-12(P1_5/NDQ5) GPIO-EXT.12
P1_6/NDQ6: AM3352-SOM-EVB-PLATFORM.2-10(P1_6/NDQ6) GPIO-EXT.10
P1_7/NDQ7: AM3352-SOM-EVB-PLATFORM.2-8(P1_7/NDQ7) GPIO-EXT.8
P1_8/UART4_RXD: AM3352-SOM-EVB-PLATFORM.4-14(P1_8/UART4_RXD) CAN1_TX/CAN0_TX.3 R51.1 UEXT2.4
P1_9/UART4_TXD: AM3352-SOM-EVB-PLATFORM.4-13(P1_9/UART4_TXD) CAN1_RX/CAN0_RX.3 UEXT2.3
P1_10/UART0_RX: AM3352-SOM-EVB-PLATFORM.2-5(P1_10/UART0_RX) D7.A GPIO-EXT.5
P1_11/UART0_TX: AM3352-SOM-EVB-PLATFORM.2-7(P1_11/UART0_TX) GPIO-EXT.7 UART0.1
P1_12/LCD_D19: AM3352-SOM-EVB-PLATFORM.1-14(P1_12/LCD_D19) LCD.14 U8.4(A:A2)
P1_13/LCD_D18: AM3352-SOM-EVB-PLATFORM.1-6(P1_13/LCD_D18) LCD.6 U9.4(A:A2)
P1_14/LCD_D17: AM3352-SOM-EVB-PLATFORM.1-23(P1_14/LCD_D17) LCD.23 U7.6(A:A3)
P1_15/LCD_D16: AM3352-SOM-EVB-PLATFORM.1-7(P1_15/LCD_D16) LCD.7 U9.6(A:A3)
P1_16/TXEN: AM3352-SOM-EVB-PLATFORM.2-30(P1_16/TXEN) U2.21(TXEN)
P1_17/RXDV [PWR]: AM3352-SOM-EVB-PLATFORM.2-40(P1_17/RXDV) R103.1
P1_18/EHRPWM1A/TXD3: AM3352-SOM-EVB-PLATFORM.2-38(P1_18/EHRPWM1A/TXD3) U2.25(TXD3)
P1_19/TXD2: AM3352-SOM-EVB-PLATFORM.2-36(P1_19/TXD2) U2.24(TXD2)
P1_20/TXD1: AM3352-SOM-EVB-PLATFORM.2-34(P1_20/TXD1) U2.23(TXD1)
P1_21/TXD0: AM3352-SOM-EVB-PLATFORM.2-39(P1_21/TXD0) U2.22(TXD0)
P1_22/TXCLK: AM3352-SOM-EVB-PLATFORM.2-37(P1_22/TXCLK) R109.1
P1_23/RXCLK: AM3352-SOM-EVB-PLATFORM.2-35(P1_23/RXCLK) R105.1
P1_24/RXD3: AM3352-SOM-EVB-PLATFORM.2-33(P1_24/RXD3) R98.1
P1_25/RXD2: AM3352-SOM-EVB-PLATFORM.2-29(P1_25/RXD2) R97.1
P1_26/RXD1: AM3352-SOM-EVB-PLATFORM.2-31(P1_26/RXD1) R96.1
P1_27/RXD0: AM3352-SOM-EVB-PLATFORM.2-27(P1_27/RXD0) R95.1
P1_28/ECOL: AM3352-SOM-EVB-PLATFORM.2-23(P1_28/ECOL) R111.1
P1_29/NCE0: AM3352-SOM-EVB-PLATFORM.2-17(P1_29/NCE0) GPIO-EXT.17
P1_30/NCE1/LCD_U/D: AM3352-SOM-EVB-PLATFORM.2-15(P1_30/NCE1/LCD_U/D) GPIO-EXT.15
P1_31/NDQS: AM3352-SOM-EVB-PLATFORM.2-6(P1_31/NDQS) GPIO-EXT.6
P2_0/LCD_L/R: AM3352-SOM-EVB-PLATFORM.2-26(P2_0/LCD_L/R) GPIO-EXT.21
P2_1/NRB1: AM3352-SOM-EVB-PLATFORM.2-28(P2_1/NRB1) GPIO-EXT.23
P2_2/NALE: AM3352-SOM-EVB-PLATFORM.2-11(P2_2/NALE) GPIO-EXT.11
P2_3/NRE: AM3352-SOM-EVB-PLATFORM.2-19(P2_3/NRE) GPIO-EXT.19
P2_4/NWE: AM3352-SOM-EVB-PLATFORM.2-9(P2_4/NWE) GPIO-EXT.9
P2_5/NCLE: AM3352-SOM-EVB-PLATFORM.2-13(P2_5/NCLE) GPIO-EXT.13
P2_6/LCD_D0: AM3352-SOM-EVB-PLATFORM.1-8(P2_6/LCD_D0) LCD.8 U9.8(A:A4)
P2_7/LCD_D1: AM3352-SOM-EVB-PLATFORM.1-9(P2_7/LCD_D1) LCD.9 U9.11(B:A1)
P2_8/LCD_D2: AM3352-SOM-EVB-PLATFORM.1-10(P2_8/LCD_D2) LCD.10 U9.13(B:A2)
P2_9/LCD_D3: AM3352-SOM-EVB-PLATFORM.1-11(P2_9/LCD_D3) LCD.11 U9.15(B:A3)
P2_10/LCD_D4: AM3352-SOM-EVB-PLATFORM.1-12(P2_10/LCD_D4) LCD.12 U9.17(B:A4)
P2_11/LCD_D5: AM3352-SOM-EVB-PLATFORM.1-15(P2_11/LCD_D5) LCD.15 U8.6(A:A3)
P2_12/LCD_D6: AM3352-SOM-EVB-PLATFORM.1-16(P2_12/LCD_D6) LCD.16 U8.8(A:A4)
P2_13/LCD_D7: AM3352-SOM-EVB-PLATFORM.1-17(P2_13/LCD_D7) LCD.17 U8.11(B:A1)
P2_14/LCD_D8: AM3352-SOM-EVB-PLATFORM.1-18(P2_14/LCD_D8) LCD.18 U8.13(B:A2)
P2_15/LCD_D9: AM3352-SOM-EVB-PLATFORM.1-19(P2_15/LCD_D9) LCD.19 U8.15(B:A3)
P2_16/LCD_D10: AM3352-SOM-EVB-PLATFORM.1-20(P2_16/LCD_D10) LCD.20 U8.17(B:A4)
P2_17/LCD_D11: AM3352-SOM-EVB-PLATFORM.1-24(P2_17/LCD_D11) LCD.24 U7.8(A:A4)
P2_18/ERXD3: AM3352-SOM-EVB-PLATFORM.3-30(P2_18/ERXD3) R102.1
P2_19/ERXD2: AM3352-SOM-EVB-PLATFORM.3-28(P2_19/ERXD2) R101.1
P2_20/ERXD1: AM3352-SOM-EVB-PLATFORM.3-26(P2_20/ERXD1) R100.1
P2_21/ERXD0: AM3352-SOM-EVB-PLATFORM.3-24(P2_21/ERXD0) R99.1
P2_22/LCD_VSYNC: AM3352-SOM-EVB-PLATFORM.1-30(P2_22/LCD_VSYNC) LCD.30 R90.1
P2_23/LCD_HSYNC: AM3352-SOM-EVB-PLATFORM.1-29(P2_23/LCD_HSYNC) LCD.29 R89.1
P2_24/LCD_CLK: AM3352-SOM-EVB-PLATFORM.1-31(P2_24/LCD_CLK) LCD.31
P2_25/LCD_DE: AM3352-SOM-EVB-PLATFORM.1-32(P2_25/LCD_DE) LCD.32 R71.1
P3_0/ECOL: AM3352-SOM-EVB-PLATFORM.3-37(P3_0/ECOL) R112.1
P3_1/ECRS: AM3352-SOM-EVB-PLATFORM.3-39(P3_1/ECRS) R114.1
P3_2/ERXERR: AM3352-SOM-EVB-PLATFORM.3-35(P3_2/ERXERR) R108.1
P3_3/ETXEN: AM3352-SOM-EVB-PLATFORM.3-31(P3_3/ETXEN) U5.21(TXEN)
P3_4/ERXDV: AM3352-SOM-EVB-PLATFORM.3-32(P3_4/ERXDV) R104.1
P3_5/I2C0-SDA: AM3352-SOM-EVB-PLATFORM.4-16(P3_5/I2C0-SDA) R45.1 UEXT1.6 UEXT2.6
P3_6/I2C0-SCL: AM3352-SOM-EVB-PLATFORM.4-15(P3_6/I2C0-SCL) R43.1 UEXT1.5 UEXT2.5
P3_7/EMU0 [PWR]: AM3352-SOM-EVB-PLATFORM.4-25(P3_7/EMU0) GPIO-EXT.31 JTAG.13 R50.1
P3_8/EMU1: AM3352-SOM-EVB-PLATFORM.4-26(P3_8/EMU1) GPIO-EXT.32 JTAG.14 R40.2 R91.1
P3_9/ETXCK: AM3352-SOM-EVB-PLATFORM.3-33(P3_9/ETXCK) R110.1
P3_10/ERXCK: AM3352-SOM-EVB-PLATFORM.3-34(P3_10/ERXCK) R106.1
P3_14/SPI1_CLK: AM3352-SOM-EVB-PLATFORM.4-19(P3_14/SPI1_CLK) UEXT2.9
P3_15/SPI1_D0(MISO): AM3352-SOM-EVB-PLATFORM.4-17(P3_15/SPI1_D0(MISO)) UEXT2.7
P3_16/SPI1_D1(MOSI): AM3352-SOM-EVB-PLATFORM.4-18(P3_16/SPI1_D1(MOSI)) UEXT2.8
P3_17/SPI1_CS0: AM3352-SOM-EVB-PLATFORM.4-20(P3_17/SPI1_CS0) R53.1 UEXT2.10
P3_18/LED1: AM3352-SOM-EVB-PLATFORM.4-21(P3_18/LED1) GPIO-EXT.27
P3_19/LCD_PWR_EN: AM3352-SOM-EVB-PLATFORM.1-35(P3_19/LCD_PWR_EN) GPIO-EXT.28 LCD.35 R10.2
P3_20/LED2: AM3352-SOM-EVB-PLATFORM.4-23(P3_20/LED2) GPIO-EXT.29 R49.1
P3_21/LED3: AM3352-SOM-EVB-PLATFORM.4-24(P3_21/LED3) GPIO-EXT.30 R48.1
PMIC_POWER_EN: AM3352-SOM-EVB-PLATFORM.3-18(PMIC_POWER_EN) GPIO-EXT.24
RXCLK: R105.2 RM2.4.1 U2.7(RXCLK/PHYAD1)
RXD0: R95.2 RM1.2.2 U2.11(RXD0/MODE0)
RXD1: R96.2 RM1.1.2 U2.10(RXD1/MODE1)
RXD2: R97.2 RM2.2.1 U2.9(RXD2/RMIISEL)
RXD3: R98.2 RM2.3.1 U2.8(RXD3/PHYAD2)
RXDV [PWR]: R103.2 U2.26(RXDV)
RXERR: R107.2 RM2.1.1 U2.13(RXER/RXD4/PHYAD0)
SYS_RESETN: AM3352-SOM-EVB-PLATFORM.2-24(SYS_RESETN) AM3352-SOM-EVB-PLATFORM.3-21(SYS_RESETN) AM3352-SOM-EVB-PLATFORM.4-28(SYS_RESETN) JTAG.15 R11.1(1.1) R35.1(1.1)
TPX1: AM3352-SOM-EVB-PLATFORM.1-37(TPX1) LCD.37
TPX2: AM3352-SOM-EVB-PLATFORM.1-38(TPX2) LCD.38
TPY1: AM3352-SOM-EVB-PLATFORM.1-39(TPY1) LCD.39
TPY2: AM3352-SOM-EVB-PLATFORM.1-40(TPY2) LCD.40
TXCLK: R109.2 U2.20(TXCLK)
TXD4: R115.2 T1.1(B) U2.18(NINT/TXER/TXD4)
USB0-DRV: AM3352-SOM-EVB-PLATFORM.3-16(USB0-DRV) R2.1 R4.2 U1.4(EN)
USB0-ID: AM3352-SOM-EVB-PLATFORM.3-12(USB0-ID) USB_OTG.ID
USB0-VBUS: AM3352-SOM-EVB-PLATFORM.3-11(USB0-VBUS) R1.1
USB0_CE: AM3352-SOM-EVB-PLATFORM.3-14(USB0_CE) R2.2
USB0_DM: AM3352-SOM-EVB-PLATFORM.3-15(USB0_DM) USB_OTG.D-
USB0_DP: AM3352-SOM-EVB-PLATFORM.3-13(USB0_DP) USB_OTG.D+
USB1-VBUS: AM3352-SOM-EVB-PLATFORM.3-5(USB1-VBUS) R16.1
USB1_CE: AM3352-SOM-EVB-PLATFORM.3-8(USB1_CE) R18.1
USB1_DM: AM3352-SOM-EVB-PLATFORM.3-9(USB1_DM) U4.25(DM0)
USB1_DP: AM3352-SOM-EVB-PLATFORM.3-7(USB1_DP) U4.26(DP0)
USB1_DRV: AM3352-SOM-EVB-PLATFORM.3-10(USB1_DRV) HOST_DRV.1
USB1_ID: AM3352-SOM-EVB-PLATFORM.3-6(USB1_ID) R21.1
VCC [PWR]: AM3352-SOM-EVB-PLATFORM.1-3(3.3V) AM3352-SOM-EVB-PLATFORM.2-3(3.3V) AM3352-SOM-EVB-PLATFORM.3-3(3.3V) AM3352-SOM-EVB-PLATFORM.4-3(3.3V) C1.2 C2.2 C3.2 C26.2 C34.2 C35.2 C47.1 C57.1 C58.1 C59.1 D1.2(K) D2.2(K) D3.2(K) GPIO-EXT.3 JTAG.5 L2.2 L9.2 LCD.3 R10.1 R13.1 R17.1 R37.1 R43.2 R44.2 R45.2 R46.2 R47.2 R50.2 R51.2 R53.2 R65.2 R91.2 RM1.1.1 RM1.2.1 RM1.3.1 RM1.4.1 RM2.1.2 RM3.1.1 RM3.2.1 RM3.3.1 RM3.4.1 T1.2(E) T2.2(E) U2.12(VDDIO) U5.12(VDDIO) U6.3(VDD) U7.20(PWR:VCC) U8.20(PWR:VCC) U9.20(PWR:VCC) UEXT1.1 UEXT2.1 ; supply symbol labelled 3.3V
VDDA_ADC: AM3352-SOM-EVB-PLATFORM.4-39(VDDA_ADC) GPIO-EXT.39
VGA_B: D1.3(AK) R56.2 R59.2 R62.2 R66.2 R72.2 R75.2 R78.2 R81.2 VGA_DB15-F.3
VGA_CTRL: FET1.3(D) R65.1 U7.1(A:G) U7.19(B:G) U8.1(A:G) U8.19(B:G) U9.1(A:G) U9.19(B:G)
VGA_G: D2.3(AK) R57.2 R60.2 R63.2 R67.2 R73.2 R76.2 R79.2 R82.2 VGA_DB15-F.2
VGA_HSYNC: D6.3(AK) FET2.3(D) R87.1 VGA_DB15-F.13
VGA_R: D3.3(AK) R58.2 R61.2 R64.2 R68.2 R74.2 R77.2 R80.2 R83.2 VGA_DB15-F.1
VGA_VSYNC: D5.3(AK) FET3.3(D) R88.1 VGA_DB15-F.14
VREFP: AM3352-SOM-EVB-PLATFORM.4-34(VREFP) GPIO-EXT.34
X1: C41.2 Q2.2 U4.6(X1)
X2: C43.2 Q2.1 U4.7(X2)
XTALI1: C42.2 Q3.2 U5.4(XTAL2)
XTALI2: C12.2 Q1.2 U2.4(XTAL2)
XTALO1: C44.2 Q3.1 U5.5(XTAL1/CLKIN)
XTALO2: C13.2 Q1.1 U2.5(XTAL1/CLKIN)
Unconnected: AM3352-SOM-EVB-PLATFORM.3-19(PWRONRSTN) JTAG.6 U4.19(#OVCUR2) U4.20(#PWREN2) U4.22(#PWREN1) U6.5(VREF) VGA_DB15-F.4 VGA_DB15-F.9 VGA_DB15-F.11 VGA_DB15-F.12 VGA_DB15-F.15

## Buses
LCD_D[0..7],LCD_D[8..15],LCD_D[16..23],LCD_HSYNC,LCD_VSYNC,LCD_CLK,LCD_DE
P2_21/ERXD0,P2_20/ERXD1,P2_19/ERXD2,P2_18/ERXD3,P3_4/ERXDV,P3_10/ERXCK,P3_2/ERXERR,P3_0/ECOL,P0_29/EPHY-RST#/RFCLK,P0_28/ETXD0,P0_21/ETXD1,P0_17/ETXD2,P0_16/ETXD3,P3_3/ETXEN,P3_9/ETXCK,P0_1/EMDC,P0_0/EMDIO,P3_1/ECRS
JTAG_TDO,JTAG_TDI,JTAG_TMS,JTAG_TCK,JTAG_TRST
USB0_DM,USB0_DP,USB0-ID,USB0-VBUS,USB0-DRV,USB0_CE,USB1_DM,USB1_DP,USB1_ID,USB1_DRV,USB1_CE
P2_0/MDIO_DATA,P2_1/NRB1/MDIO_CLK,P1_16/TXCLK,P0_31/NWP/TXEN,P1_20/TXD0,P1_19/TXD1,P1_18/EHRPWM1A/TXD2,P1_17/TXD3,P1_27/RXER,P1_25/RXCLK,P1_26/RXDV,P1_24/RXD0,P1_23/RXD1,P1_22/RXD2,P1_21/RXD3
B$1
B$2

## Notes on the sheet
- GPIO Extension
- USB0-OTG
- GMII2_TXD0
- GMII2_TXD1
- GMII2_TXD2
- GMII2_TXD3
- GMII2_TXEN
- GMII2_TXCLK
- GMII2_RXD0
- Iset = 6800/Rs
- GMII2_RXD1
- Rs
- Iset = 523mA | GMII2_RXD2
- GMII2_RXD3
- GMII2_RXDV
- WAKE-UP | GMII2_RXCLK
- GMII2_RXERR
- LED3 | LED2
- MDIO_CLK
- MDIO_DATA
- GMII2_CRS
- GMII2_COL
- USB1-HOSTs
- The PHY is setted up as follows:
- AM3352-SOM-EVB Interconnectors | MODE: All capable(10/100Base).
- Auto-negotiation enabled.
- MII Configuration
- Ako moje matrici!!! | SMI address: 0x01
- Ako moje matrici!!!
- Ako moje matrici!!!
- Iset = 6800/R48
- Iset = 1000mA
- Ethernets
- PR1
- PR1 | PR1
- PR1 | PR1
- PR1 | PR1
- PR1 | PR1
- PR1 | PR1
- PR1 | PR1
- PR1 | PR1
- GMII1_TXD0
- GMII1_TXD1
- GMII1_TXD2
- GMII1_TXD3
- GMII1_TXEN
- GMII1_TXCLK
- GMII1_RXD0
- GMII1_RXD1
- GMII1_RXD2
- GMII1_RXD3
- GMII1_RXDV
- Notes:
- ===== | NC (PWRONRSTN) | GMII1_RXCLK
- 1. PWREN1# is the only power-
- GMII1_RXERR
- enable output for GANG mode;
- 2. OVCUR1# is the only over
- current flag for GANG mode;
- MDIO_CLK
- 3. Gang mode means that power
- management affects whole 4
- ports as a group; | MDIO_DATA
- 4. Individual power management,
- i.e. individual mode is not
- supported on SSOP28 package!
- GMII1_CRS
- GMII1_COL
- The PHY is setted up as follows:
- MODE: All capable(10/100Base).
- CAN DRIVER
- Auto-negotiation enabled.
- DCAN0_RX | DCAN0_TX | Ako moje matrici!!! | MII Configuration
- Ako moje matrici!!! | SMI address: 0x00
- Ako moje matrici!!!
- DCAN1_RX | DCAN1_TX
- DCAN1_TX
- DCAN0_TX | LED2 | LED3
- DCAN0_RX
- DCAN1_RX
- UEXTs | JTAG
- PR0
- PR0 | PR0
- PR0 | PR0
- Button | LEDs | PR0
- PR0
- PR0 | PR0
- PR0 | PR0
- PR0 | PR0
- DCAN1_RX | DCAN1_TX
- VGA | LCD Connector
- Power Supply | UART0
- B0 | G0 | R0
- B1 | G1 | R1
- B2 | G2 | R2
- B3 | G3 | R3
- 5.0V | GND
- 3.3V | GND
- R0 | R1 | Ra
- R2 | R3
- PR0
- B4 | G4 | R4 | R4 | R5
- PR0 | PR0
- B5 | G5 | R5 | R6 | R7
- PR0 | PR0
- B6 | G6 | R6 | G0 | G1
- B7 | G7 | R7 | G2 | G3
- PR0 | Fiducials:
- 6-16VDC | Vout=0.923x(1+Ra/Rb)
- G4 | G5
- G6 | G7
- B0 | B1
- B2 | B3 | Rb
- B4 | B5
- PR0
- B6 | B7
- PR0 | PR0
- HSYNC | VSYNC
- PR0 | PR0
- CLK | DE
- PR0 | PR0
- L/R | U/D
- PWRE | BKL
- X1 | X2
- Y1 | Y2

## Power pins joined to a net without a drawn wire
GND: VGA_DB15-F.GND1 VGA_DB15-F.GND2

## Library data of the parts
5V_E CAN_T HOST_DRV = jumper:SJ: SMD solder JUMPER
AM3352-SOM-EVB-PLATFORM = OLIMEX_CASES:AM3352-SOM-EVB: AM3352-SOM-EVB-PLATFORM
C1-C50 C52-C73 C214 = rcl:C-EU: CAPACITOR, European symbol
C51 = rcl:CPOL-EU: POLARIZED CAPACITOR, European symbol
CAN = DOUBLE-SIDE:CON3: CONNECTORS - 3 PINS
CAN1_RX/CAN0_RX CAN1_TX/CAN0_TX UART0 = jumper:JP2E: JUMPER
D1-D3 D5 D6 = semicon-smd-ipc:DIODE_AC-AC_: DUAL DIODE
D4 = OLIMEX_DISCRET:SMBJ16A
D7 = gogo:SCHOTKKY7.62SS
FET1-FET3 = Penko:N-MOS+DIOD
FID1-FID3 = SparkFunEagle-6-6-07:FIDUCIAL: Fiducial Alignment Points Various fiducial points for machine vision alignment.
GND_PIN = gogo:TESTPAD: drill 40mils, diameter 70mils
GPIO-EXT LCD = con-harting-ml:ML40: HARTING
JTAG = con-harting-ml:ML20: HARTING
L1-L10 = rcl:L-US: INDUCTOR, American symbol
L11 = OLIMEX_DISCRET:L
LAN1 LAN2 = OLIMEX_CONNECTORS:RJLBC-060TC1_GND
LED2 LED3 PWR_LED = DOUBLE-SIDE:LED
PWR = gogo:PWR-JAK
Q1-Q3 = crystal:HC49/S: CRYSTAL
R1-R10 R12-R34 R36-R116 = rcl:R-EU_: RESISTOR, European symbol
R11 R35 R117 = OLIMEX_DISCRET:R_0R
RM1-RM4 = OLIMEX_DISCRET:R_MATRIX_4E
T1 T2 = OLIMEX_DISCRET:DIGITAL_TRANSISTORS-PNP: DTA114YKA Digital Transistor - PNP
U1 U3 = OLIMEX_IC:SY6280
U2 U5 = OLIMEX_IC:LAN8710A: LAN8710A/LAN8710Ai Small Footprint MII/RMII 10/100 Ethernet Transceiver with HP Auto-MDIX and flexPWR® Technology
U4 = OLIMEX_IC:GL850G
U6 = arm:MCP2551
U7-U9 = 74AC244:74ALVC244
U10 = OLIMEX_IC:MP1482
UEXT1 UEXT2 = con-harting-ml:ML10: HARTING
USB_HOST1-USB_HOST4 = OLIMEX_CONNECTORS:USB_SHIELD
USB_OTG = OLIMEX_CONNECTORS:MINI_USB9
USB_PWR_E = jumper:JP1E: JUMPER
VGA_DB15-F = OLIMEX_CONNECTORS:DB15
WAKE-UP = gogo:SW-TAKT

## Net classes
2 lan_sh: drill 0.762 mm